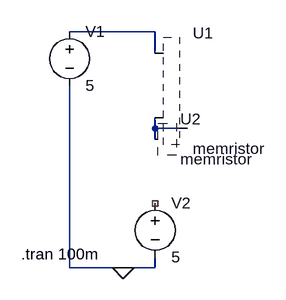
[diagram p0: schematic AND.asc]
AND.asc, the LTspice schematic file:
Version 4
SHEET 1 880 680
WIRE 192 80 64 80
WIRE 192 112 192 80
WIRE 192 224 192 208
WIRE 240 224 192 224
WIRE 192 240 192 224
WIRE 64 432 64 160
WIRE 144 432 64 432
WIRE 192 432 192 416
WIRE 192 432 144 432
FLAG 144 432 0
SYMBOL memristor 192 160 R0
SYMATTR InstName U1
SYMBOL memristor 192 288 R0
SYMATTR InstName U2
SYMBOL voltage 64 64 R0
SYMATTR InstName V1
SYMATTR Value 5
SYMBOL voltage 192 320 R0
SYMATTR InstName V2
SYMATTR Value 5
TEXT -8 412 Left 2 !.tran 100m

The netlist it stands for:
* AND.asc
* U1: memristor (symbol memristor not available, pin order unknown); nets seen at it: N001, N002
* U2: memristor (symbol memristor not available, pin order unknown); nets seen at it: N002
V1 N001 0 5
V2 NC_01 0 5
.tran 100m
.backanno
.end